# EAGLE schematic PCB_ALIM diodes adaptées version 8 (EAGLE 9.6.2)

## Sheet 1 of 2
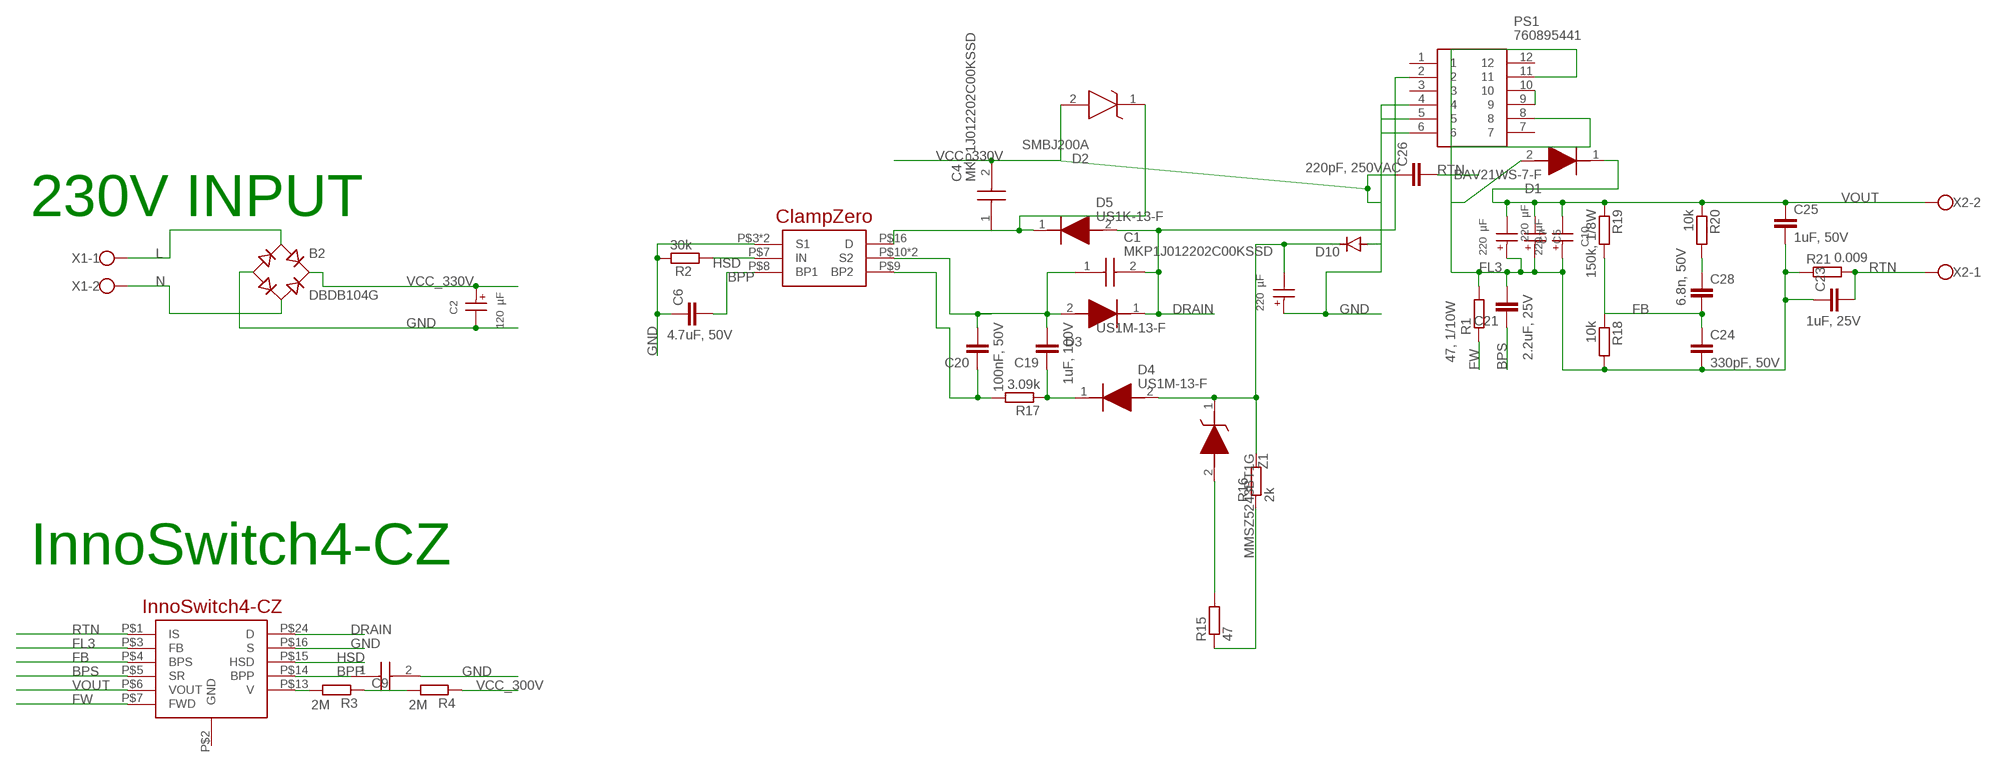
[diagram p0: schematic, sheet 1]

### Parts
B2  DBDB104G  [DB]
C1  MKP1J012202C00KSSD  [MKP1J012202C00KSSD]
C2  120 µF  WCAP-ATG8_18X41_860011381013  [WCAP-ATG8_18X41X7.5(DXL)]
C4  MKP1J012202C00KSSD  [MKP1J012202C00KSSD]
C5  220 µF  WCAP-ASLI_10X10.5_865080657018  [WCAP-ASLI_10X10.5(DXL)]
C6  4.7uF, 50V  C-EUC0603  [C0603]
C7  220 µF  WCAP-ASLI_10X10.5_865080657018  [WCAP-ASLI_10X10.5(DXL)]
C8  220 µF  WCAP-ASLI_10X10.5_865080657018  [WCAP-ASLI_10X10.5(DXL)]
C9  MKP1J012202C00KSSD  [MKP1J012202C00KSSD]
C10  220 µF  WCAP-ASLI_10X10.5_865080657018  [WCAP-ASLI_10X10.5(DXL)]
C19  1uF, 100V  C-EUC0603  [C0603]
C20  100nF, 50V  C-EUC0603  [C0603]
C21  2.2uF, 25V  C-EUC0603  [C0603]
C23  1uF, 25V  C-EUC0603  [C0603]
C24  330pF, 50V  C-EUC0603  [C0603]
C25  1uF, 50V  C-EUC0603  [C0603]
C26  220pF, 250VAC  C-EUC0603  [C0603]
C28  6.8n, 50V  C-EUC0603  [C0603]
D1  BAV21WS-7-F  [SOD2513X120N]
D2  SMBJ200A  [DIOM5436X261N]
D3  US1M-13-F  [SODFL5226X240N]
D4  US1M-13-F  [SODFL5226X240N]
D5  US1K-13-F  [DIOM5226X240N]
D10  1N4933  [DO41-10]
PS1  760895441  [DIPS2800W80P550L3600H2600Q12N]
R1  47, 1/10W  R-EU_R0603  [R0603]
R2  30k  R-EU_R0603  [R0603]
R3  2M  R-EU_R0603  [R0603]
R4  2M  R-EU_R0603  [R0603]
R15  47  R-EU_R0603  [R0603]
R16  2k  R-EU_R0603  [R0603]
R17  3.09k  R-EU_R0603  [R0603]
R18  10k  R-EU_R0603  [R0603]
R19  150k, 1/8W  R-EU_R0603  [R0603]
R20  10k  R-EU_R0603  [R0603]
R21  0.009  R-EU_R0603  [R0603]
U$3  CLAMPZERO  [MINSOP-16A]
U$4  INNOSWITCH4-CZ  [INSOP-24D]
X1  W237-102  [W237-102]
X2  W237-102  [W237-102]
Z1  MMSZ5243BT1G  [SOD3716X135N]

### Nets
BPP: C6.2 C9.1 U$3.P$8(BP1) U$4.P$14(BPP)
BPS: C21.1 U$4.P$5(SR)
DRAIN: C1.2 D3.1(K) D5.2(A) PS1.2 U$4.P$24(D)
FB: C24.1 C28.2 R18.1 R19.2 U$4.P$4(BPS)
FL3: C5.1(+) C7.1(+) C10.1(+) C21.2 C23.1 C24.2 C25.2 PS1.11 R1.2 R18.2 R21.1 U$4.P$3(FB)
FW: R1.1 U$4.P$7(FWD)
GND: B2.- C2.2(-) C6.1 C8.1(+) C9.2 PS1.6 R2.2 U$3.P$3(S1) U$3.P$6(S1) U$4.P$16(S)
HSD: R2.1 U$3.P$7(IN) U$4.P$15(HSD)
L: B2.AC1 X1.1
N: B2.AC2 X1.2
N$1: C8.2(-) D4.2(A) D10.C R16.2 Z1.1(K)
N$2: R15.2 Z1.2(A)
N$3: PS1.9 PS1.10
N$4: C28.1 R20.2
N$6: R3.2 U$4.P$13(V)
N$7: R3.1 R4.2
N$8: C1.1 C19.2 C20.2 D3.2(A) U$3.P$10(S2) U$3.P$11(S2)
N$9: C19.1 D4.1(K) R17.1
N$10: C20.1 R17.2 U$3.P$9(BP2)
N$11: D10.A PS1.5
N$12: C4.1 D2.1(K) D5.1(K) U$3.P$16(D)
N$13: R15.1 R16.1
N$21: D1.2(A) PS1.8
RTN: C23.2 C26.2 R21.2 U$4.P$1(IS) X2.1
VCC_300V: R4.1
VCC_330V: B2.+ C2.1(+) C4.2 C26.1 D2.2(A) PS1.4
VOUT: C5.2(-) C7.2(-) C10.2(-) C25.1 D1.1(K) R19.1 R20.1 U$4.P$6(VOUT) X2.2
Unconnected: PS1.1 PS1.3 PS1.7 PS1.12 U$4.P$2(GND)

### Notes on the sheet
- 230V INPUT
- InnoSwitch4-CZ

## Sheet 2 of 2

## Library data of the parts
B2 = rectifier:DB?*G: Single Phase 1.0 AMP Glass Passivated Bridge Rectifier Taiwan Semiconductor Co.,Ltd. - TSC Source: http://www.taiwansemi.com/TSCbig5/ezcatfiles/cust/img/img/db101g.pdf http://www.ts.com.tw/db/pictures/modules/PDT/PDT060207001/DBLS201G.pdf
C1 C4 C9 = MKP1J012202C00KSSD:MKP1J012202C00KSSD: Film Capacitors 630V 2200pF 10% Source: Datasheet <https://www.wima.de/wp-content/uploads/media/e_WIMA_MKP_10.pdf>; DESCRIPTION: Film Capacitors 630V 2200pF 10%; HEIGHT: 9mm; MANUFACTURER_NAME: WIMA; MANUFACTURER_PART_NUMBER: MKP1J012202C00KSSD; MOUSER_PART_NUMBER: 505-M102200/630/10; MOUSER_PRICE-STOCK: https://www.mouser.co.uk/ProductDetail/WIMA/MKP1J012202C00KSSD?qs=ISKKXg98%252B1mgvXB3mGEyXQ%3D%3D
C2 = Eagle_WCAP-ATG8 (rev20a):WCAP-ATG8_18X41: WCAP-ATG8 Aluminium Electrolytic Capacitors General Purpose +85 °C Characteristics General purpose product series with max. operating temperature of +85 °C Wide range of capacitance value Mounting style: THT Radial Capacitance range: 0.1 µF ‒ 33000 µF Capacitance tolerance: ±20 % Voltage range (UR): 10 ‒ 400 V(DC) Operating temperature: -40 °C up to +85 °C for UR < 400 V(DC) -25 °C up to +85 °C for UR ≥ 400 V(DC) Endurance: 2000 h @ +85 °C Dimensions (DxL) in mm: 5.0 x 11.0 up to 22.0 x 51.0 Recommended soldering: Wave soldering Applications Filtering Smoothing Energy storage Coupling <https://www.we-online.com/catalog/media/o35732v209%20WCAP-ATG8_4C.jpg> Details see: https://www.we-online.com/catalog/en/WCAP-ATG8/ Updated by yingchun,Shan;2020-02-27 2020(C) Würth Elektronik; DATASHEET-URL: https://www.we-online.com/catalog/datasheet/860011381013.pdf; DF: 15%; DIAMETER: 18mm; I-LEAK: 1440uA; I-RIPPLE: 520mA; L: 41mm; OPERATING-TEMPERATURE: -40 °C up to +85 °C; PART-NUMBER: 860011381013; PITCH: 7.5mm; TECHNICAL-REFERENCE: ATAL410121M400DSPS1B000; VR: 400V(DC)
C5 C7 C8 C10 = Eagle_WCAP-ASLI (rev20a):WCAP-ASLI_10X10.5: WCAP-ASLI Aluminium Electrolytic Capacitors Low Impedance +105 °C Characteristics Low impedance product series Mounting style: V-Chip SMT Capacitance range: 0.1 µF ‒ 6800 µF Capacitance tolerance: ±20 % Voltage range (UR): 6.3 ‒ 100 V(DC) Operating temperature: -55 °C up to +105 °C Endurance: 2000 h @ +105 °C Dimensions (DxL) in mm: 4.0 x 5.5 up to 16.0 x 17.0 Recommended soldering: Reflow soldering Applications Low impedance, especially for filtering applications Input and output capacitor for switched-mode power supply Filtering Smoothing e.g. DC/DC converter, AC/DC converter, satellite receiver, control panel <https://www.we-online.com/catalog/media/o14723v209%20Family_WCAP-ASLI.jpg> Details see: https://www.we-online.com/catalog/en/WCAP-ASLI/ Updated by yingchun,Shan;2020-03-03 2020(C) Würth Elektronik; DATASHEET-URL: https://www.we-online.com/catalog/datasheet/865080657018.pdf; DF: 12%; DIAMETER: 10mm; I-LEAK: 110uA; I-RIPPLE: 650mA; L: 10.5mm; OPERATING-TEMPERATURE: -55 °C up to +105 °C; PART-NUMBER: 865080657018; TECHNICAL-REFERENCE: ASEF105221M050DVCTEB000; VR: 50V(DC)
C6 C19-C21 C23-C26 C28 = rcl:C-EU: CAPACITOR, European symbol
D1 = BAV21WS-7-F:BAV21WS-7-F: Diodes Inc BAV21WS-7-F Switching Diode Source: Datasheet <https://componentsearchengine.com/Datasheets/2/BAV21WS-7-F.pdf>; ARROW_PART_NUMBER: BAV21WS-7-F; ARROW_PRICE-STOCK: https://www.arrow.com/en/products/bav21ws-7-f/diodes-incorporated?region=nac; DESCRIPTION: Diodes Inc BAV21WS-7-F Switching Diode; HEIGHT: 1.2mm; MANUFACTURER_NAME: Diodes Inc.; MANUFACTURER_PART_NUMBER: BAV21WS-7-F; MOUSER_PART_NUMBER: 621-BAV21WS-F; MOUSER_PRICE-STOCK: https://www.mouser.co.uk/ProductDetail/Diodes-Incorporated/BAV21WS-7-F?qs=YvhBCnANyPsfd19lPwY%252BKQ%3D%3D
D2 = SMBJ200A:SMBJ200A: Littelfuse SMBJ200A, Uni-Directional TVS Diode, 600W, 2-Pin DO-214AA Source: Datasheet <https://m.littelfuse.com/~/media/electronics/datasheets/tvs_diodes/littelfuse_tvs_diode_smbj_datasheet.pdf.pdf>; ARROW_PART_NUMBER: SMBJ200A; ARROW_PRICE-STOCK: https://www.arrow.com/en/products/smbj200a/littelfuse?region=nac; DESCRIPTION: Littelfuse SMBJ200A, Uni-Directional TVS Diode, 600W, 2-Pin DO-214AA; HEIGHT: 2.61mm; MANUFACTURER_NAME: LITTELFUSE; MANUFACTURER_PART_NUMBER: SMBJ200A; MOUSER_PART_NUMBER: 576-SMBJ200A; MOUSER_PRICE-STOCK: https://www.mouser.co.uk/ProductDetail/Littelfuse/SMBJ200A?qs=JJML70Qc14u62%252Bryrz1EOg%3D%3D
D3 D4 = US1M-13-F:US1M-13-F: Diode Fast 1A 1000V 75ns SMA Diodes Inc US1M-13-F, SMT Switching Diode, 1000V 1A, 75ns, 2-Pin DO-214AC Source: Datasheet <https://www.diodes.com/assets/Datasheets/ds16008.pdf>; ARROW_PART_NUMBER: US1M-13-F; ARROW_PRICE-STOCK: https://www.arrow.com/en/products/us1m-13-f/diodes-incorporated?region=europe; DESCRIPTION: Diode Fast 1A 1000V 75ns SMA Diodes Inc US1M-13-F, SMT Switching Diode, 1000V 1A, 75ns, 2-Pin DO-214AC; HEIGHT: 2.4mm; MANUFACTURER_NAME: Diodes Inc.; MANUFACTURER_PART_NUMBER: US1M-13-F; MOUSER_PART_NUMBER: 621-US1M-F; MOUSER_PRICE-STOCK: https://www.mouser.co.uk/ProductDetail/Diodes-Incorporated/US1M-13-F?qs=eQQ5Ftq4seWl6gFwdb8vMg%3D%3D
D5 = US1K-13-F:US1K-13-F: Diodes Inc US1K-13-F Switching Diode, 1A 800V, 2-Pin SMA Source: Datasheet <https://www.diodes.com/assets/Datasheets/ds16008.pdf>; ARROW_PART_NUMBER: US1K-13-F; ARROW_PRICE-STOCK: https://www.arrow.com/en/products/us1k-13-f/diodes-incorporated; DESCRIPTION: Diodes Inc US1K-13-F Switching Diode, 1A 800V, 2-Pin SMA; HEIGHT: 2.4mm; MANUFACTURER_NAME: Diodes Inc.; MANUFACTURER_PART_NUMBER: US1K-13-F; MOUSER_PART_NUMBER: 621-US1K-F; MOUSER_PRICE-STOCK: https://www.mouser.co.uk/ProductDetail/Diodes-Incorporated/US1K-13-F?qs=mGuGFjoQO77tAHeJoOiWyQ%3D%3D
D10 = diode:1N4933: DIODE fast recovery rectifier, 1A
PS1 = 760895441:760895441: WE-LLCR Resonant Converter 600uH 150 W 1 Output 150W Resonant Converter, 24V Source: Datasheet <http://katalog.we-online.com/pbs/datasheet/760895441.pdf>; DESCRIPTION: WE-LLCR Resonant Converter 600uH 150 W 1 Output 150W Resonant Converter, 24V; HEIGHT: 26mm; MANUFACTURER_NAME: Wurth Elektronik; MANUFACTURER_PART_NUMBER: 760895441; MOUSER_PART_NUMBER: 710-760895441; MOUSER_PRICE-STOCK: https://www.mouser.co.uk/ProductDetail/Wurth-Elektronik/760895441?qs=AAveGqk956E4qjNou%2F6iQA%3D%3D
R1-R4 R15-R21 = rcl:R-EU_: RESISTOR, European symbol
U$3 = PowerIntegrations:CLAMPZERO
U$4 = PowerIntegrations:INNOSWITCH4-CZ
X1 X2 = con-wago-500:W237-102: WAGO SCREW CLAMP; MPN: 237-102; OC_FARNELL: unknown; OC_NEWARK: 70K9898
Z1 = MMSZ5243BT1G:MMSZ5243BT1G: ON Semiconductor MMSZ5243BT1G Zener Diode, 13V 5% 0.5 W SMT 2-Pin SOD-123 Source: Datasheet <http://www.onsemi.com/pub/Collateral/MMSZ5221BT1-D.PDF>; ARROW_PART_NUMBER: MMSZ5243BT1G; ARROW_PRICE-STOCK: https://www.arrow.com/en/products/mmsz5243bt1g/on-semiconductor; DESCRIPTION: ON Semiconductor MMSZ5243BT1G Zener Diode, 13V 5% 0.5 W SMT 2-Pin SOD-123; HEIGHT: 1.35mm; MANUFACTURER_NAME: onsemi; MANUFACTURER_PART_NUMBER: MMSZ5243BT1G; MOUSER_PART_NUMBER: 863-MMSZ5243BT1G; MOUSER_PRICE-STOCK: https://www.mouser.co.uk/ProductDetail/ON-Semiconductor/MMSZ5243BT1G?qs=P4IOph%252Bbot9jmJtv%252Bfx8eg%3D%3D